# Altium schematic sheet 330E_Transistor_Logic.SchDoc
size A4
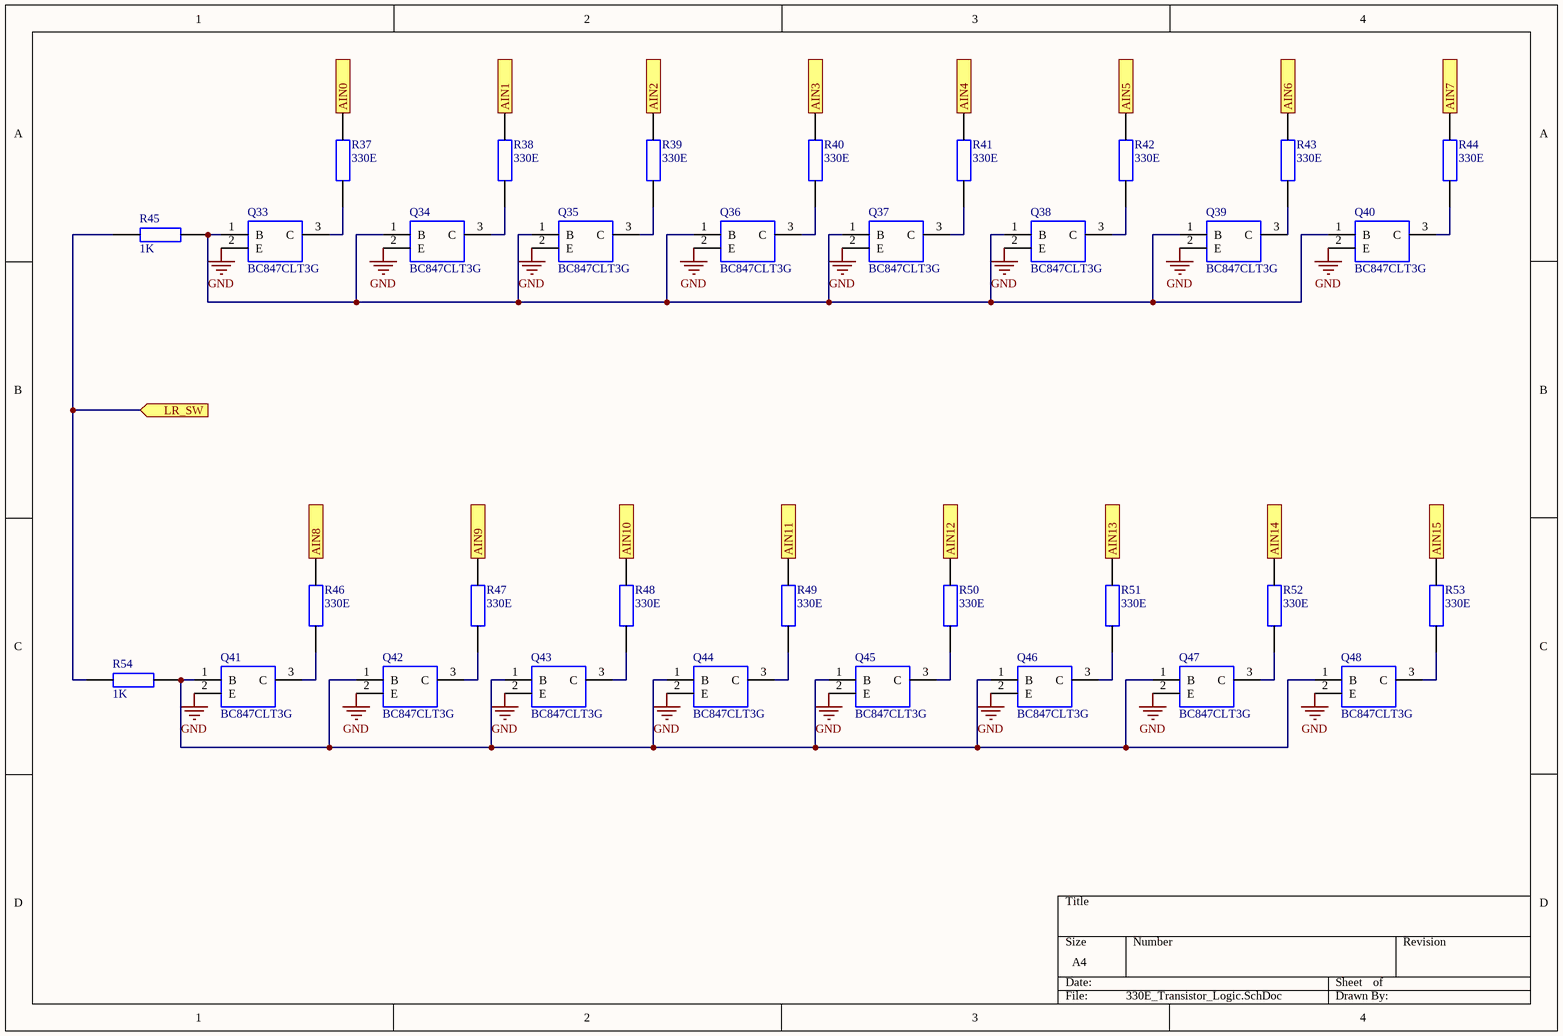
[diagram p0: 330E_Transistor_Logic.SchDoc]

## Parts
Q33  BC847CLT3G  [SOT96P237X111-3N]
Q34  BC847CLT3G  [SOT96P237X111-3N]
Q35  BC847CLT3G  [SOT96P237X111-3N]
Q36  BC847CLT3G  [SOT96P237X111-3N]
Q37  BC847CLT3G  [SOT96P237X111-3N]
Q38  BC847CLT3G  [SOT96P237X111-3N]
Q39  BC847CLT3G  [SOT96P237X111-3N]
Q40  BC847CLT3G  [SOT96P237X111-3N]
Q41  BC847CLT3G  [SOT96P237X111-3N]
Q42  BC847CLT3G  [SOT96P237X111-3N]
Q43  BC847CLT3G  [SOT96P237X111-3N]
Q44  BC847CLT3G  [SOT96P237X111-3N]
Q45  BC847CLT3G  [SOT96P237X111-3N]
Q46  BC847CLT3G  [SOT96P237X111-3N]
Q47  BC847CLT3G  [SOT96P237X111-3N]
Q48  BC847CLT3G  [SOT96P237X111-3N]
R37  330E  [RESC1608X55N]
R38  330E  [RESC1608X55N]
R39  330E  [RESC1608X55N]
R40  330E  [RESC1608X55N]
R41  330E  [RESC1608X55N]
R42  330E  [RESC1608X55N]
R43  330E  [RESC1608X55N]
R44  330E  [RESC1608X55N]
R45  1K  [RESC1608X55N]
R46  330E  [RESC1608X55N]
R47  330E  [RESC1608X55N]
R48  330E  [RESC1608X55N]
R49  330E  [RESC1608X55N]
R50  330E  [RESC1608X55N]
R51  330E  [RESC1608X55N]
R52  330E  [RESC1608X55N]
R53  330E  [RESC1608X55N]
R54  1K  [RESC1608X55N]

## Ports
AIN0 (out), AIN1 (out), AIN2 (out), AIN3 (out), AIN4 (out), AIN5 (out), AIN6 (out), AIN7 (out), AIN8 (out), AIN9 (out), AIN10 (out), AIN11 (out), AIN12 (out), AIN13 (out), AIN14 (out), AIN15 (out), LR_SW (in)

## Nets
GND: Q33.2(E) Q34.2(E) Q35.2(E) Q36.2(E) Q37.2(E) Q38.2(E) Q39.2(E) Q40.2(E) Q41.2(E) Q42.2(E) Q43.2(E) Q44.2(E) Q45.2(E) Q46.2(E) Q47.2(E) Q48.2(E)
AIN0: R37.2 ; port AIN0
AIN1: R38.2 ; port AIN1
AIN2: R39.2 ; port AIN2
AIN3: R40.2 ; port AIN3
AIN4: R41.2 ; port AIN4
AIN5: R42.2 ; port AIN5
AIN6: R43.2 ; port AIN6
AIN7: R44.2 ; port AIN7
AIN8: R46.2 ; port AIN8
AIN9: R47.2 ; port AIN9
AIN10: R48.2 ; port AIN10
AIN11: R49.2 ; port AIN11
AIN12: R50.2 ; port AIN12
AIN13: R51.2 ; port AIN13
AIN14: R52.2 ; port AIN14
AIN15: R53.2 ; port AIN15
LR_SW: R45.1 R54.1 ; port LR_SW
NetQ33_1: Q33.1(B) Q34.1(B) Q35.1(B) Q36.1(B) Q37.1(B) Q38.1(B) Q39.1(B) Q40.1(B) R45.2
NetQ33_3: Q33.3(C) R37.1
NetQ34_3: Q34.3(C) R38.1
NetQ35_3: Q35.3(C) R39.1
NetQ36_3: Q36.3(C) R40.1
NetQ37_3: Q37.3(C) R41.1
NetQ38_3: Q38.3(C) R42.1
NetQ39_3: Q39.3(C) R43.1
NetQ40_3: Q40.3(C) R44.1
NetQ41_1: Q41.1(B) Q42.1(B) Q43.1(B) Q44.1(B) Q45.1(B) Q46.1(B) Q47.1(B) Q48.1(B) R54.2
NetQ41_3: Q41.3(C) R46.1
NetQ42_3: Q42.3(C) R47.1
NetQ43_3: Q43.3(C) R48.1
NetQ44_3: Q44.3(C) R49.1
NetQ45_3: Q45.3(C) R50.1
NetQ46_3: Q46.3(C) R51.1
NetQ47_3: Q47.3(C) R52.1
NetQ48_3: Q48.3(C) R53.1

## Library data of the parts
Q33-Q48 = BC847CLT3G: Manufacturer_Name: ON Semiconductor; Geometry.Height: 1.11mm; Manufacturer_Part_Number: BC847CLT3G; Arrow Part Number: BC847CLT3G; Arrow Price/Stock: https://www.arrow.com/en/products/bc847clt3g/on-semiconductor; Mouser Part Number: 863-BC847CLT3G; Mouser Price/Stock: https://www.mouser.co.uk/ProductDetail/ON-Semiconductor/BC847CLT3G?qs=vNc2DXHODiIVMr372epecQ%3D%3D; Datasheet Link: http://www.onsemi.com/pub/Collateral/BC846ALT1-D.PDF
R37-R44 R46-R53 = RC0603FR-07330RL: YAGEO (PHYCOMP) - RC0603FR-07330RL - RES, THICK FILM, 330R, 1%, 0.1W, 0603; Geometry.Height: 0.55mm; Manufacturer_Name: YAGEO (PHYCOMP); Manufacturer_Part_Number: RC0603FR-07330RL; Arrow Part Number: RC0603FR-07330RL; Arrow Price/Stock: https://www.arrow.com/en/products/rc0603fr-07330rl/yageo; Mouser Part Number: 603-RC0603FR-07330RL; Mouser Price/Stock: https://www.mouser.co.uk/ProductDetail/Yageo/RC0603FR-07330RL?qs=diQw95jMAeN1335dAOzMfg%3D%3D; Datasheet Link: http://www.yageo.com/documents/recent/PYu-RC0603_51_RoHS_L_v5.pdf
R45 R54 = RC0603JR-071KL: YAGEO (PHYCOMP) - RC0603JR-071KL - RES, THICK FILM, 1K, 5%, 0.1W, 0603; Geometry.Height: 0.55mm; Manufacturer_Name: YAGEO (PHYCOMP); Manufacturer_Part_Number: RC0603JR-071KL; Arrow Part Number: RC0603JR-071KL; Arrow Price/Stock: https://www.arrow.com/en/products/rc0603jr-071kl/yageo; Mouser Part Number: 603-RC0603JR-071KL; Mouser Price/Stock: https://www.mouser.co.uk/ProductDetail/Yageo/RC0603JR-071KL?qs=%2F9ZTgpVJnN7bctK4R%2FDEoA%3D%3D; Datasheet Link: http://www.yageo.com/documents/recent/PYu-RC0603_51_RoHS_L_v5.pdf